# Altium schematic sheet ThermalExtSens.SchDoc
size A4; SheetNumber: 26
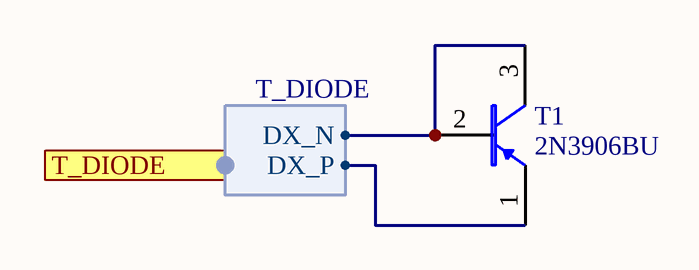
[diagram p0: ThermalExtSens.SchDoc]

## Parts
T1  2N3906BU  [TO-92-3]

## Ports
T_DIODE (harness T_DIODE)

## Harnesses
T_DIODE: DX_P, DX_N

## Nets
NetT1_1: T1.1(EMITTER) ; port T_DIODE.DX_P
NetT1_2: T1.2(BASIS) T1.3(COLLECTOR) ; port T_DIODE.DX_N

## Notes on the sheet
- Title
- Revision:
- Design Engineer:
- Date:
- Project:
- Sheet
- of

## Library data of the parts
T1 = 2N3906BU: Bipolartransistor, PNP; Manufacturer: onsemi; Number Of Channels: single; Collector Emitter Voltage: 40V; Power Dissipation: 625mW; Value: 40V; Created from: MGeier; Manufacturer Part Number: 2N3906BU; PartID: 4; Created On: 29/03/2025 21:55:00; ComponentLink1Description: Datasheet; ComponentLink1URL: https://www.onsemi.com/download/data-sheet/pdf/2n3906-d.pdf; Component Type: Bipolartransistor; Device Package: TO-92-3; Last Updated: 29/03/2025 21:55:00; Mounting Type: THT; Operating Temperature: -55 - 150°C; Series: 2N3906; Supplier 1: LCSC; Supplier Part Number 1: C124483; Type: Bipolartransistor; Collector Basis Voltage: 40V; Polarization: PNP; Live Cycle Status: 1; LCSC Part Number: C124483